# EAGLE board SniperBoard (EAGLE 6.4)
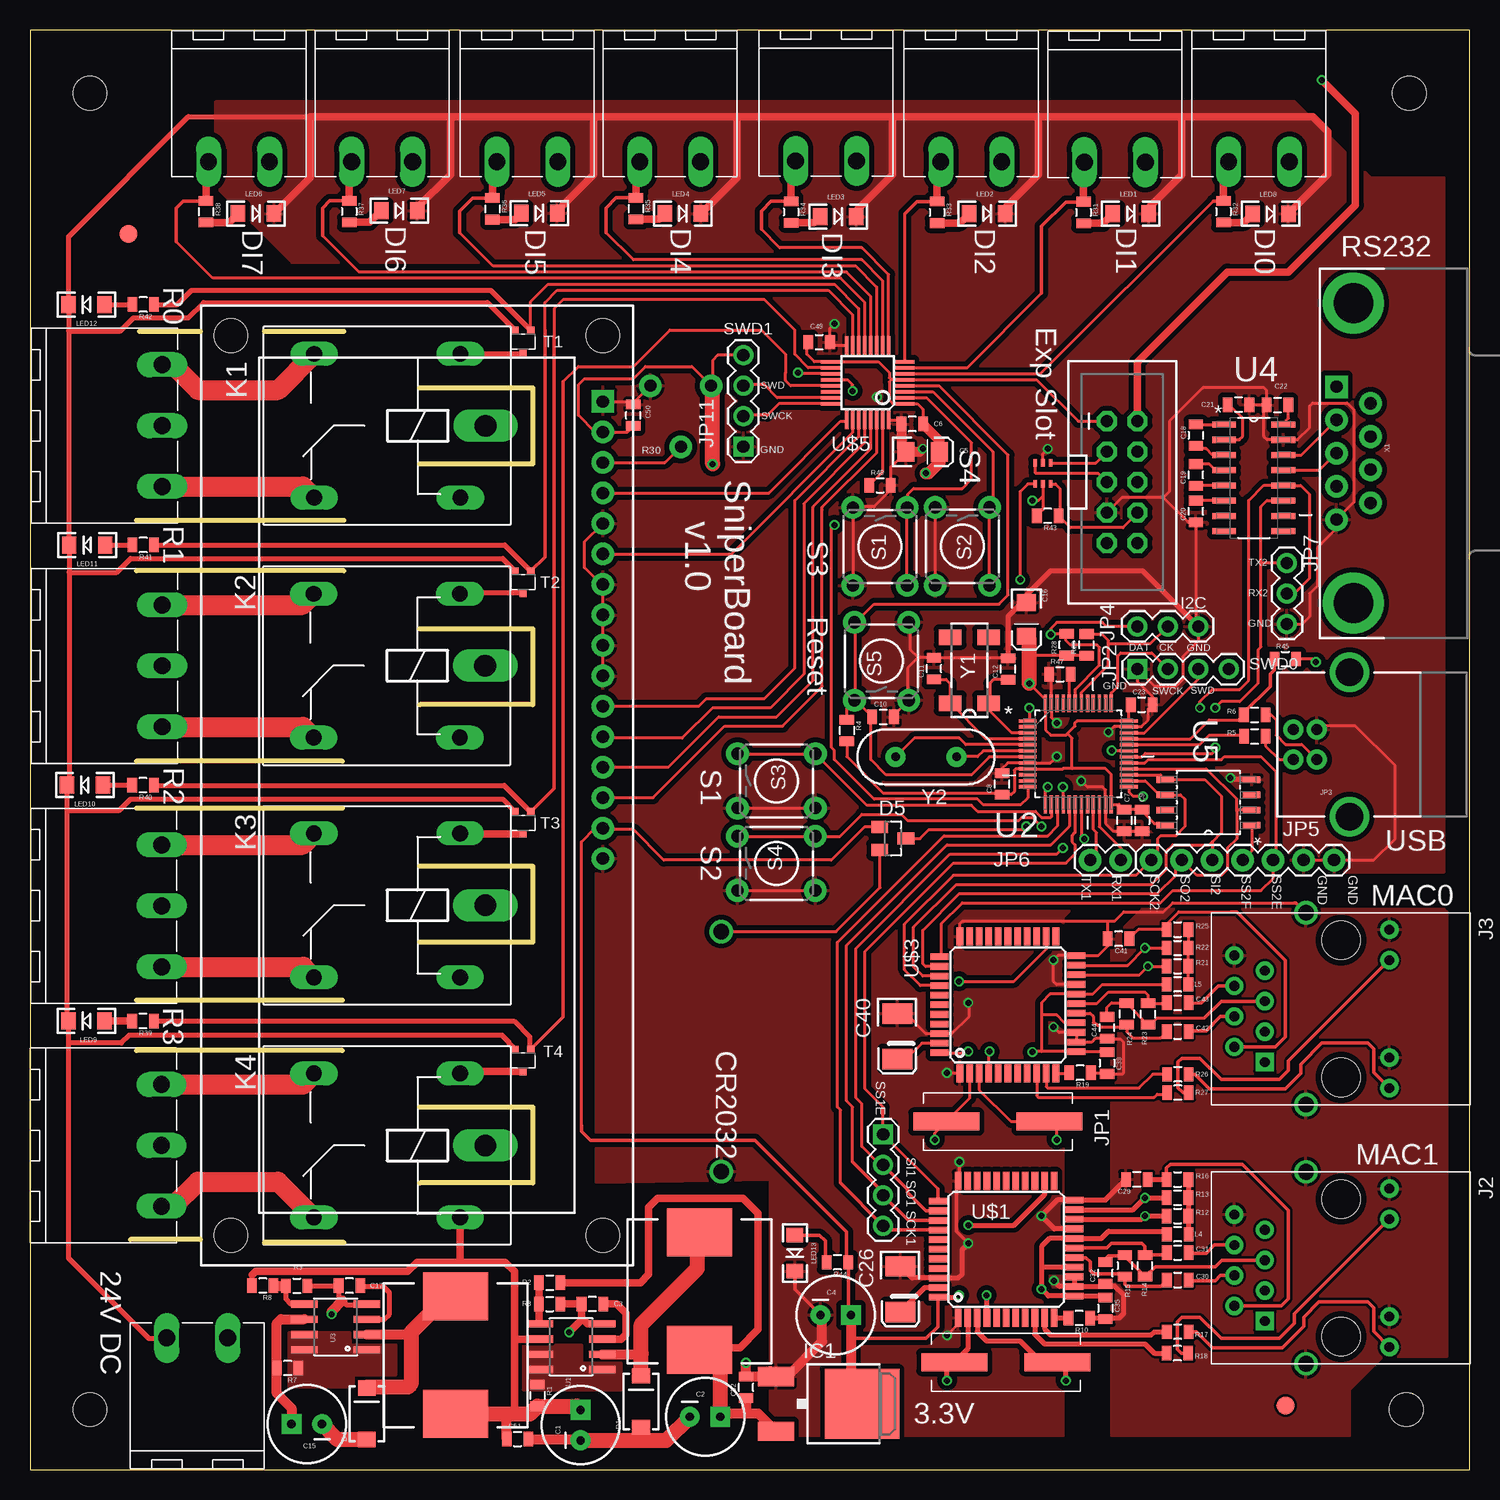
[diagram p5: board, top side]
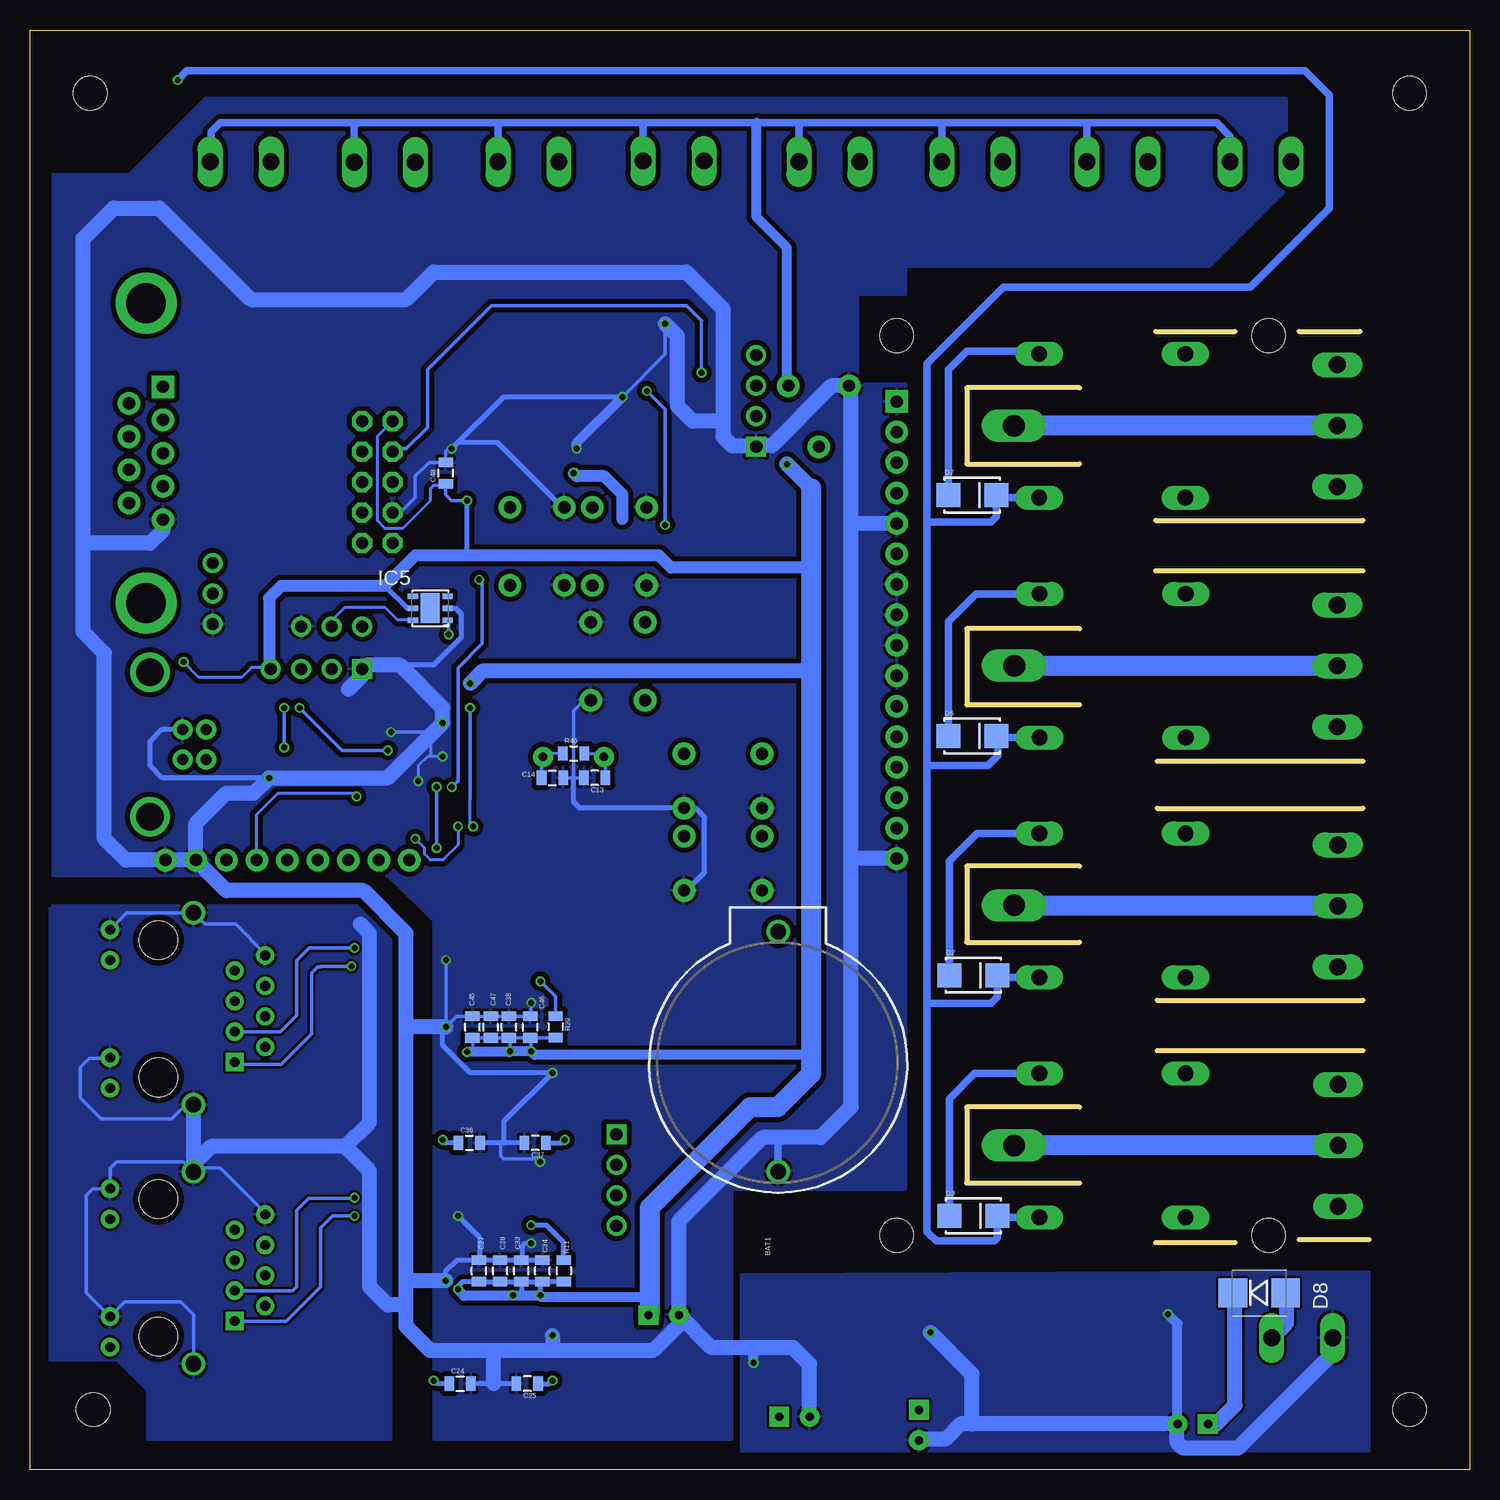
[diagram p6: board, bottom side, seen from below]

Size 120 x 120 mm. Coordinates in mm from the lower left corner, seen from the top.
Outline: 0,0 120,0 120,120 0,120 0,0
Copper layers (1*16): Top 0.035mm / dielectric 1.6mm / Bottom 0.035mm
Design rules "Elecrow_2-layer_PCB_eagle_rule *": minimum track width 8mil, minimum drill 12mil, track to track 8mil, track to pad 8mil, pad to pad 8mil, via to via 8mil, smd to smd 8mil, copper to edge 20mil, drill to drill 10mil, minimum pad ring 6mil, minimum via ring 6mil, stop-mask expansion 0mil, vias tented up to drill 100mil, thermal gap 10mil
Holes 2.8 mm at 5,114.73 114.99,114.73 114.73,5 5,5
Milling: 22 lines

## Footprints (pad centres in the part's own frame; a part is rotated, then mirrored left to right if it is on the bottom)
BATTCOM_20MM_PTH = drill 1.3: 1 20,0; 2 0,0
CPOL-RADIAL-100UF-25V = drill 0.7 pad 1.651 square: 1 1.27,0 | drill 0.7 pad 1.651: 2 -1.27,0
0805 = smd 0.8 x 1.2: 1 -0.9,0; 2 0.9,0
EIA3216 = smd 1.4 x 1.6: A 1.4,0; C -1.4,0
EIA3528-KIT = smd 1.7 x 2.5: A 1.9,0; C -1.9,0
SMA-DIODE = smd 1.27 x 1.47: A -2.15,0; C 2.15,0
SMA-DIODE_ALT = smd 2 x 2: A -2,0; C 2,0
SOT23 = smd 1 x 1.4: 1 -0.95,-1.1; 2 0.95,-1.1; 3 0,1.1
SMB-DIODE = smd 2.4 x 2.4: A 2.2,0; C -2.2,0
FIDUCIAL-1.5X3 = smd 1.5 x 1.5: 1 0,0
DPACK = smd 1.6 x 3: 1 -2.28,-4.8; 3 2.28,-4.8 | smd 5.8 x 6.2: 4 0,2.38
DFN6-3X3 = smd 0.85 x 0.45: 1 -1.45,1; 2 -1.45,0; 3 -1.45,-1; 4 1.45,-1; 5 1.45,0; 6 1.45,1 | smd 1.6 x 2.5: EXP 0,0
RJ45-ABRACON-111008B = drill 0.813 pad 1.524 square: 1 -6.35,-4.445 | drill 0.813 pad 1.524: 2 -8.89,-3.175; 3 -6.35,-1.905; 4 -8.89,-0.635; 5 -6.35,0.635; 6 -8.89,1.905; 7 -6.35,3.175; 8 -8.89,4.445; 9 4.039,-6.604; 10 4.039,-4.064; 11 4.039,4.064; 12 4.039,6.604 | drill 1.3 pad 1.778: SHIELD0 -2.921,8.001; SHIELD1 -2.921,-8.001 | hole 3.2: 0,-5.715; 0,5.715
1X04 = drill 1.016 pad 1.676 square: 1 0,0 | drill 1.016 pad 1.676: 2 2.54,0; 3 5.08,0; 4 7.62,0
USB-B-PTH = drill 0.914 pad 1.676: D+ 0,1.25; D- 1.981,1.25; GND 0,-1.25; VBUS 1.981,-1.25 | drill 2.286: S1 -2.718,-6.02; S2 -2.718,6.02
1X03 = drill 1.016 pad 1.676: 1 0,0; 2 2.54,0; 3 5.08,0
1X07 = drill 1.016 pad 1.88: 1 0,0; 2 2.54,0; 3 5.08,0; 4 7.62,0; 5 10.16,0; 6 12.7,0; 7 15.24,0
1X02 = drill 1.016 pad 1.88: 1 0,0; 2 2.54,0
2X5-SHROUDED = drill 1.016 pad 1.676 octagon: 1 -1.27,5.08; 2 1.27,5.08; 3 -1.27,2.54; 4 1.27,2.54; 5 -1.27,0; 6 1.27,0; 7 -1.27,-2.54; 8 1.27,-2.54; 9 -1.27,-5.08; 10 1.27,-5.08
ZF112 = drill 1.321 long: 1 -6.096,5.994; 2 -6.096,-5.994; O 6.096,5.994; S 6.096,-5.994 | drill 1.803 long: P -8.204,0
CDRH125 = smd 5.4 x 4: 1 0,4.9; 2 0,-4.9
LED-1206 = smd 1.2 x 1.4: A -1.5,0; C 1.5,0
TRIM_POT_PTH = drill 1 pad 1.88: 1 -2.54,-2.54; 2 0,2.54; 3 2.54,-2.54
TACTILE-PTH = drill 1.016 pad 1.88: 1 -3.251,2.261; 2 3.251,2.261; 3 -3.251,-2.261; 4 3.251,-2.261
SOT323 = smd 0.6 x 0.6: 1 -0.65,-0.925; 2 0.65,-0.925; 3 0,0.925
SO08 = smd 0.61 x 2.21: 1 -1.905,-2.616; 2 -0.635,-2.616; 3 0.635,-2.616; 4 1.905,-2.616; 5 1.905,2.616; 6 0.635,2.616; 7 -0.635,2.616; 8 -1.905,2.616
QFP50P900X900X160-48N = smd 1.473 x 0.279: 1 -4.216,2.743; 2 -4.216,2.261; 3 -4.216,1.753; 4 -4.216,1.245; 5 -4.216,0.762; 6 -4.216,0.254; 7 -4.216,-0.254; 8 -4.216,-0.762; 9 -4.216,-1.245; 10 -4.216,-1.753; 11 -4.216,-2.261; 12 -4.216,-2.743; 25 4.216,-2.743; 26 4.216,-2.261; 27 4.216,-1.753; 28 4.216,-1.245; 29 4.216,-0.762; 30 4.216,-0.254; 31 4.216,0.254; 32 4.216,0.762; 33 4.216,1.245; 34 4.216,1.753; 35 4.216,2.261; 36 4.216,2.743 | smd 0.279 x 1.473: 13 -2.743,-4.216; 14 -2.261,-4.216; 15 -1.753,-4.216; 16 -1.245,-4.216; 17 -0.762,-4.216; 18 -0.254,-4.216; 19 0.254,-4.216; 20 0.762,-4.216; 21 1.245,-4.216; 22 1.753,-4.216; 23 2.261,-4.216; 24 2.743,-4.216; 37 2.743,4.216; 38 2.261,4.216; 39 1.753,4.216; 40 1.245,4.216; 41 0.762,4.216; 42 0.254,4.216; 43 -0.254,4.216; 44 -0.762,4.216; 45 -1.245,4.216; 46 -1.753,4.216; 47 -2.261,4.216; 48 -2.743,4.216
SOIC127P600X175-16N = smd 1.981 x 0.508: 1 -2.464,4.445; 2 -2.464,3.175; 3 -2.464,1.905; 4 -2.464,0.635; 5 -2.464,-0.635; 6 -2.464,-1.905; 7 -2.464,-3.175; 8 -2.464,-4.445; 9 2.464,-4.445; 10 2.464,-3.175; 11 2.464,-1.905; 12 2.464,-0.635; 13 2.464,0.635; 14 2.464,1.905; 15 2.464,3.175; 16 2.464,4.445
SOIC127P800X215-8N = smd 1.473 x 0.533: 1 -3.607,1.905; 2 -3.607,0.635; 3 -3.607,-0.635; 4 -3.607,-1.905; 5 3.607,-1.905; 6 3.607,-0.635; 7 3.607,0.635; 8 3.607,1.905
LCD-16X2 = drill 1.016 pad 1.88 square: 1 -32,15.5 | drill 1.016 pad 1.88: 2 -29.46,15.5; 3 -26.92,15.5; 4 -24.38,15.5; 5 -21.84,15.5; 6 -19.3,15.5; 7 -16.76,15.5; 8 -14.22,15.5; 9 -11.68,15.5; 10 -9.14,15.5; 11 -6.6,15.5; 12 -4.06,15.5; 13 -1.52,15.5; 14 1.02,15.5; 15 3.56,15.5; 16 6.1,15.5 | hole 2.8: -37.5,15.5; -37.5,-15.5; 37.5,15.5; 37.5,-15.5
TQFP-44 = smd 1.5 x 0.55: 1 -5.7,4; 2 -5.7,3.2; 3 -5.7,2.4; 4 -5.7,1.6; 5 -5.7,0.8; 6 -5.7,0; 7 -5.7,-0.8; 8 -5.7,-1.6; 9 -5.7,-2.4; 10 -5.7,-3.2; 11 -5.7,-4; 23 5.7,-4; 24 5.7,-3.2; 25 5.7,-2.4; 26 5.7,-1.6; 27 5.7,-0.8; 28 5.7,0; 29 5.7,0.8; 30 5.7,1.6; 31 5.7,2.4; 32 5.7,3.2; 33 5.7,4 | smd 0.55 x 1.5: 12 -3.9,-5.7; 13 -3.1,-5.7; 14 -2.3,-5.7; 15 -1.5,-5.7; 16 -0.7,-5.7; 17 0.1,-5.7; 18 0.9,-5.7; 19 1.7,-5.7; 20 2.5,-5.7; 21 3.3,-5.7; 22 4.1,-5.7; 34 4,5.7; 35 3.2,5.7; 36 2.4,5.7; 37 1.6,5.7; 38 0.8,5.7; 39 0,5.7; 40 -0.8,5.7; 41 -1.6,5.7; 42 -2.4,5.7; 43 -3.2,5.7; 44 -4,5.7
1X02_TERMB_RA = drill 1.4 long: P$1 0,2.54; P$2 0,-2.54
SC70-6 = smd 0.61 x 0.305: P$1 -0.85,0; P$2 0.9,0; P$3 0.9,-0.65; P$4 -0.85,-0.65; P$5 -0.85,-1.3; P$6 0.9,-1.3
LQFP-32 = smd 0.279 x 1.575: 1 -1.75,-3.1; 2 -1.25,-3.1; 3 -0.75,-3.1; 4 -0.25,-3.1; 5 0.25,-3.1; 6 0.75,-3.1; 7 1.25,-3.1; 8 1.75,-3.1; 17 1.75,3.1; 18 1.25,3.1; 19 0.75,3.1; 20 0.25,3.1; 21 -0.25,3.1; 22 -0.75,3.1; 23 -1.25,3.1; 24 -1.75,3.1 | smd 1.575 x 0.279: 9 3.1,-1.75; 10 3.1,-1.25; 11 3.1,-0.75; 12 3.1,-0.25; 13 3.1,0.25; 14 3.1,0.75; 15 3.1,1.25; 16 3.1,1.75; 25 -3.1,1.75; 26 -3.1,1.25; 27 -3.1,0.75; 28 -3.1,0.25; 29 -3.1,-0.25; 30 -3.1,-0.75; 31 -3.1,-1.25; 32 -3.1,-1.75
1X03_TERMB_RA = drill 1.4 long: P$1 0,5.08; P$2 0,0; P$3 0,-5.08
DB9 = drill 1.016 pad 1.88 square: 1 -5.54,-1.42 | drill 1.016 pad 1.88: 2 -2.77,-1.42; 3 0,-1.42; 4 2.77,-1.42; 5 5.54,-1.42; 6 -4.15,1.42; 7 -1.38,1.42; 8 1.38,1.42; 9 4.15,1.42 | drill 3.302 pad 5.08: G1 -12.5,0; G2 12.5,0
MC-306 = smd 1.3 x 1.9: 1 -2.75,-1.6; 2 2.75,-1.6; 3 2.75,1.6; 4 -2.75,1.6
HC49US = drill 0.7 pad 1.651: 1 -2.54,0; 2 2.54,0
CRYSTAL-SMD-10.5X4.8-2PIN = smd 5.5 x 1.5: P$1 -4.3,0; P$2 4.3,0

## Placement (x,y rotation side)
BAT1  3V  [BATTCOM_20MM_PTH]  57.63,24.84 90 bottom
C1  100uF  [CPOL-RADIAL-100UF-25V]  45.9,3.7 90 top
C2  470uF  [CPOL-RADIAL-100UF-25V]  56.28,4.39 0 top
C3  470pF  [0805]  46.88,13.79 180 top
C4  470uF  [CPOL-RADIAL-100UF-25V]  67.17,12.88 0 top
C5  10uF  [EIA3216]  74.42,84.84 0 top
C6  0.1uF  [0805]  73.55,87.16 180 top
C7  0.1uF  [0805]  91.21,54.1 270 top
C8  0.1uF  [0805]  81.03,57.15 90 top
C9  0.1uF  [0805]  92.71,54.1 270 top
C10  0.1uF  [0805]  71.12,62.74 0 top
C11  20pF  [0805]  75.36,66.77 90 top
C12  20pF  [0805]  81.53,66.74 90 top
C13  27pF  [0805]  72.93,57.65 180 bottom
C14  27pF  [0805]  76.45,57.66 0 bottom
C15  100uF  [CPOL-RADIAL-100UF-25V]  23.08,3.79 180 top
C16  10uF  [EIA3216]  83.06,70.87 270 top
C17  220pF  [0805]  26.63,15.32 180 top
C18  0.1uF  [0805]  97.19,86.22 270 top
C19  0.1uF  [0805]  97.19,82.92 90 top
C20  0.1uF  [0805]  97.19,79.87 90 top
C21  0.1uF  [0805]  100.74,88.76 180 top
C22  0.1uF  [0805]  104,88.74 0 top
C23  0.1uF  [0805]  92.67,63.77 0 top
C24  27pF  [0805]  84.14,7.16 0 bottom
C25  27pF  [0805]  78.55,7.16 180 bottom
C26  10uF  [EIA3528-KIT]  72.55,15.03 270 top
C27  0.1uF  [0805]  82.59,16.56 90 bottom
C28  0.1uF  [0805]  80.81,16.56 90 bottom
C29  0.01uF  [0805]  92.27,24.18 180 top
C30  0.01uF  [0805]  95.67,15.8 0 top
C31  0.01uF  [0805]  95.67,18.08 0 top
C32  0.01uF  [0805]  89.65,16.38 90 top
C33  0.1uF  [0805]  79.06,16.56 90 bottom
C34  0.1uF  [0805]  77.28,16.56 90 bottom
C35  0.1uF  [0805]  89.65,13.43 270 top
C36  27pF  [0805]  83.38,27.23 0 bottom
C37  27pF  [0805]  77.89,27.23 180 bottom
C38  0.1uF  [0805]  80.07,36.88 90 bottom
C39  0.1uF  [0805]  89.78,33.88 270 top
C40  10uF  [EIA3528-KIT]  72.3,36.12 270 top
C41  0.01uF  [0805]  90.74,44.24 180 top
C42  0.01uF  [0805]  95.67,36.5 0 top
C43  0.01uF  [0805]  95.67,38.91 0 top
C44  0.01uF  [0805]  89.78,36.83 90 top
C45  0.1uF  [0805]  83.12,36.88 90 bottom
C46  0.1uF  [0805]  78.3,36.88 90 bottom
C47  0.1uF  [0805]  81.6,36.88 90 bottom
C48  0.1uF  [0805]  85.34,83.06 90 bottom
C49  0.1uF  [0805]  65.79,93.98 0 top
C50  0.1uF  [0805]  50.29,87.88 90 top
C51  0.1uF  [0805]  40.64,2.54 0 top
C52  0.1uF  [0805]  59.69,6.86 90 top
D1  STPS2L40U  [SMA-DIODE]  50.94,5.66 90 top
D2  1N4148WS-V-GS18  [SMA-DIODE_ALT]  41.35,41.21 0 bottom
D3  1N4148WS-V-GS18  [SMA-DIODE_ALT]  41.35,21.14 0 bottom
D4  STPS2L40U  [SMA-DIODE]  28.08,4.65 90 top
D5  BAS40-05  [SOT23]  71.93,52.6 270 top
D6  1N4148WS-V-GS18  [SMA-DIODE_ALT]  41.45,61.16 0 bottom
D7  1N4148WS-V-GS18  [SMA-DIODE_ALT]  41.45,81.22 0 bottom
D8  [SMB-DIODE]  17.53,14.73 0 bottom
FID1  FIDUCIAL1.5X3  [FIDUCIAL-1.5X3]  104.65,5.33 0 top
FID2  FIDUCIAL1.5X3  [FIDUCIAL-1.5X3]  8.22,103 0 top
IC1  LD117ADT12TR  [DPACK]  66.98,5.48 270 top
IC5  SI7006-A10-IM  [DFN6-3X3]  86.64,71.8 180 bottom
J2  RJ45-ABRACON-11108B  [RJ45-ABRACON-111008B]  109.28,16.81 0 top
J3  RJ45-ABRACON-11108B  [RJ45-ABRACON-111008B]  109.28,38.4 0 top
JP1  [1X04]  71.12,27.94 270 top
JP2  SWD0  [1X04]  92.31,66.72 0 top
JP3  USB-B  [USB-B-PTH]  107.28,60.44 180 top
JP4  [1X03]  97.38,70.28 180 top
JP5  [1X07]  108.71,50.8 180 top
JP6  [1X02]  90.93,50.8 180 top
JP7  [1X03]  104.78,70.48 90 top
JP11  [1X04]  59.47,85.26 90 top
JP12  M05X2SHD  [2X5-SHROUDED]  91.05,82.31 0 top
K1  ZF112  [ZF112]  29.77,87.01 180 top
K2  ZF112  [ZF112]  29.74,67 180 top
K3  ZF112  [ZF112]  29.76,47.03 180 top
K4  ZF112  [ZF112]  29.76,27.01 180 top
L1  68uH  [CDRH125]  55.8,14.87 0 top
L3  68uH  [CDRH125]  35.48,9.54 0 top
L4  10uH  [0805]  95.67,19.61 180 top
L5  10uH  [0805]  95.67,40.43 180 top
LED1  Green  [LED-1206]  91.76,104.69 0 top
LED2  Green  [LED-1206]  79.8,104.69 0 top
LED3  Green  [LED-1206]  67.38,104.45 0 top
LED4  Green  [LED-1206]  54.42,104.7 0 top
LED5  Green  [LED-1206]  42.45,104.72 0 top
LED6  Green  [LED-1206]  18.85,104.7 0 top
LED7  Green  [LED-1206]  30.78,104.94 0 top
LED8  Green  [LED-1206]  103.41,104.67 0 top
LED9  Green  [LED-1206]  4.7,37.4 180 top
LED10  Green  [LED-1206]  4.57,57.05 180 top
LED11  Green  [LED-1206]  4.77,77.07 180 top
LED12  Green  [LED-1206]  4.71,97.11 180 top
LED13  Green  [LED-1206]  63.75,18.03 270 top
R1  0.68R  [0805]  42.31,6.17 270 top
R2  3.6K  [0805]  43.32,15.57 0 top
R3  1.2K  [0805]  43.32,13.79 0 top
R4  10K  [0805]  68.09,61.61 270 top
R5  22R  [0805]  102.09,61.12 0 top
R6  22R  [0805]  102.08,62.9 0 top
R7  0.68R  [0805]  21.48,8.46 180 top
R8  13K  [0805]  19.41,15.33 180 top
R9  1.5K  [0805]  22.24,15.32 0 top
R10  12.4K  [0805]  87.47,12.63 180 top
R11  100K  [0805]  75.5,16.56 270 bottom
R12  49.9R  [0805]  95.67,21.13 0 top
R13  49.9R  [0805]  95.67,22.65 0 top
R14  49.9R  [0805]  92.95,16.99 90 top
R15  49.9R  [0805]  91.27,16.99 270 top
R16  10R  [0805]  95.67,24.18 0 top
R17  470R  [0805]  95.67,11.48 180 top
R18  470R  [0805]  95.64,9.7 180 top
R19  12.4K  [0805]  87.54,33.07 180 top
R20  100K  [0805]  76.19,36.91 270 bottom
R21  49.9R  [0805]  95.67,41.96 0 top
R22  49.9R  [0805]  95.67,43.48 0 top
R23  49.9R  [0805]  93.2,37.97 90 top
R24  49.9R  [0805]  91.43,37.97 270 top
R25  10R  [0805]  95.67,45.01 0 top
R26  470R  [0805]  95.69,32.94 180 top
R27  470R  [0805]  95.69,31.42 180 top
R28  10K  [0805]  86.42,68.76 90 top
R29  10K  [0805]  88.08,68.75 90 top
R30  TRIMPOT 10K  [TRIM_POT_PTH]  54.25,87.8 180 top
R31  470R  [0805]  87.83,104.79 270 top
R32  470R  [0805]  99.49,104.85 270 top
R33  470R  [0805]  75.61,104.8 270 top
R34  470R  [0805]  63.44,104.82 270 top
R35  470R  [0805]  50.51,105.11 270 top
R36  470R  [0805]  38.56,105.09 270 top
R37  470R  [0805]  26.62,104.86 270 top
R38  470R  [0805]  14.68,104.85 270 top
R39  470R  [0805]  9.42,37.39 180 top
R40  470R  [0805]  9.42,57.04 180 top
R41  470R  [0805]  9.43,77.07 180 top
R42  470R  [0805]  9.43,97.12 180 top
R43  10K  [0805]  84.84,79.5 180 top
R44  470R  [0805]  67.31,17.27 180 top
R45  1.5K  [0805]  104.65,67.56 0 top
R46  1M  [0805]  74.68,59.69 0 bottom
R47  100K  [0805]  85.85,66.29 0 top
R48  100K  [0805]  70.87,82.04 0 top
S1  [TACTILE-PTH]  70.86,76.95 270 top
S2  [TACTILE-PTH]  77.72,76.96 270 top
S3  [TACTILE-PTH]  62.23,57.4 0 top
S4  [TACTILE-PTH]  62.22,50.53 0 top
S5  [TACTILE-PTH]  70.99,67.38 90 top
T1  2N7002PW  [SOT323]  41.1,94.04 180 top
T2  2N7002PW  [SOT323]  41.1,73.97 180 top
T3  2N7002PW  [SOT323]  41.1,53.91 180 top
T4  2N7002PW  [SOT323]  41.1,34.09 180 top
U1  MC34063SMD  [SO08]  45.1,10.24 90 top
U2  STM32F103CBT6  [QFP50P900X900X160-48N]  87.39,59.66 0 top
U3  MC34063SMD  [SO08]  25.48,11.89 90 top
U4  ST232CDR  [SOIC127P600X175-16N]  102.01,82.66 0 top
U5  S25FL016K0XMFI011  [SOIC127P800X215-8N]  98.23,55.61 180 top
U6  LCD-16X2SILK  [LCD-16X2]  32.25,57.03 270 top
U$1  ENC424J600  [TQFP-44]  81.37,18.36 90 top
U$2  1X02_TERMB_RA  [1X02_TERMB_RA]  13.95,10.97 270 top
U$3  ENC424J600  [TQFP-44]  81.52,38.73 90 top
U$4  NC7SP157  [SC70-6]  85.09,83.06 270 top
U$5  STM32F030K6T6-LQFP-32  [LQFP-32]  69.83,90.6 90 top
U$6  1X02_TERMB_RA  [1X02_TERMB_RA]  102.45,109.03 90 top
U$7  1X02_TERMB_RA  [1X02_TERMB_RA]  90.43,108.98 90 top
U$8  1X02_TERMB_RA  [1X02_TERMB_RA]  66.36,109.08 90 top
U$9  1X02_TERMB_RA  [1X02_TERMB_RA]  41.45,109.03 90 top
U$10  1X02_TERMB_RA  [1X02_TERMB_RA]  17.42,109.03 90 top
U$11  1X02_TERMB_RA  [1X02_TERMB_RA]  29.35,109.03 90 top
U$12  1X02_TERMB_RA  [1X02_TERMB_RA]  53.37,109.03 90 top
U$13  1X02_TERMB_RA  [1X02_TERMB_RA]  78.46,109.03 90 top
U$14  1X03_TERMB_RA  [1X03_TERMB_RA]  11.02,87.02 180 top
U$15  1X03_TERMB_RA  [1X03_TERMB_RA]  11.02,66.99 180 top
U$16  1X03_TERMB_RA  [1X03_TERMB_RA]  10.98,46.99 180 top
U$17  1X03_TERMB_RA  [1X03_TERMB_RA]  10.96,27.02 180 top
X1  [DB9]  110.33,84.72 270 top
Y1  32.768Khz  [MC-306]  78.31,66.63 90 top
Y2  8Mhz  [HC49US]  74.69,59.4 180 top
Y3  25Mhz  [CRYSTAL-SMD-10.5X4.8-2PIN]  81.34,8.94 180 top
Y4  25Mhz  [CRYSTAL-SMD-10.5X4.8-2PIN]  80.68,29 180 top

## Tracks (layer width: path | path; a pad name or v marks a point on that pad's centre or on a via)
3.3V  (via drill 0.5 pad 0.81)
  Top 0.254: L5.2 89.39,40.43 88.59,39.63 U$3.18 85.04,39.63 84.31,38.91 84.31,37.89 | C39.1 89.72,34.83 U$3.12 84.33,34.83 | 84.33,34.83 83.6,34.83 v83.57,34.8 | U$3.4 79.92,34.77 v80,34.85 | U$3.44 78.11,34.73 v78.22,34.85 | U$3.15 86.24,37.23 85.58,37.89 84.31,37.89 | U5.8 94.48,53.85 93.73,53.85 92.71,54.86 C9.1 C7.1 90.78,55.44 U2.24 90.14,57.95 89.66,58.42 86.87,58.42 | C23.1 91.61,63.61 U2.36 87.29,62.4 87.12,62.23 87.12,61.98 86.49,61.34 | 86.87,58.42 86.11,58.42 86.1,58.41 U2.9 82.16,58.41 82.04,58.29 82.04,56.52 81.79,56.26 81.04,56.26 C8.1 80.89,56.39 71.12,56.39 68.09,59.42 R4.2 | C50.1 49.79,86.49 U6.2 47.12,86.49 45.72,87.88 45.72,90.42 46.23,90.93 50.29,90.93 51.31,91.95 55.18,91.95 R30.1 56.9,90.45 56.9,92.46 57.32,92.88 JP11.4 | C49.1 64.77,93.86 64.77,92.96 65.39,92.35 U$5.17 70.72,92.35 71.63,91.44 71.63,91.02 71.8,90.85 | C6.1 74.42,87.19 74.42,88.39 73.97,88.85 U$5.1 71.93,88.85 71.63,89.15 71.63,90.68 71.8,90.85 | D5.1 69.55,53.55 66.8,50.8 52.83,50.8 50.29,53.34 47.88,53.34 U6.15 47.12,53.47 45.97,52.32 45.97,28.7 | R43.2 84.44,80.01 U$4.P$3 84.44,81.14 84.07,80.77 v83.57,80.77 | 84.31,37.89 84.31,34.85 84.33,34.83 | 86.87,58.42 86.87,60.96 86.49,61.34 | 86.49,61.34 86.36,61.21 85.09,61.21 84.65,61.66 U2.48 84.65,64.19 v83.31,65.53 | JP12.1 89.77,87.38 87.38,87.38 83.9,90.85 U$5.5 71.8,90.85 | v107.19,67.31 106.93,67.56 R45.2 | R29.1 86.43,67.85 R28.1 83.35,67.86 83.31,67.82
  Top 0.305: U$1.44 75.67,11.91 74.68,10.92 68.69,10.92 68.44,10.67 | 45.97,28.7 45.97,28.19 46.74,27.43 60.45,27.43 68.07,19.81 68.07,17.41 R44.1 68.21,13.11 C4.1
  Top 0.406: L4.2 94.52,19.86 89.9,19.86 89.3,19.26 U$1.18 84.98,19.26 84.31,18.59 84.31,16.81 | C35.1 89.52,14.46 U$1.12 84.89,14.46 v84.31,15.03 84.31,16.81 | U$1.4 79.77,14.5 v79.74,14.53 | U$1.44 77.29,14.36 v77.46,14.53 | U$1.15 84.36,16.86 84.31,16.81
  Top 0.813: C4.1 68.44,10.67 68.44,6.4 IC1.4 | C5.A 75.82,85.79 C6.1
  Top 1.016: v74.68,83.06 74.93,83.06 75.82,83.95 C5.A
  Top 1.27: v83.31,65.53 83.31,67.82 83.31,69.21 C16.A | v56.9,83.82 56.9,90.24 R30.1
  Bottom 0.254: v83.57,34.8 83.31,34.8 83.06,35.05 83.06,35.92 C45.1 | C48.1 85.46,82.04 86.36,82.04 86.61,81.79 86.61,80.77 88.9,78.49 90.42,78.49 91.03,79.1 91.03,86.13 JP12.1 | 100.08,66.86 101.54,66.86 102.36,66.04 105.92,66.04 v107.19,67.31
  Bottom 0.305: C46.1 C38.1 | C38.1 C47.1 C45.1 83.24,35.86 | v80,34.85 80,35.9 C38.1 | C46.1 76.21,35.98 R20.2 | v78.22,34.85 78.22,35.9 C46.1 | v83.57,80.77 84.84,80.77 85.34,81.28 C48.1 | 68.33,12.99 C4.1 | 68.33,13.72 68.33,14.25 | 68.33,14.25 68.44,14.37 | 68.33,14.25 68.33,16.26 68.07,16.51
  Bottom 0.406: v84.31,15.03 84.31,15.29 83.95,15.66 C27.1 C28.1 C33.1 | C33.1 C34.1 | v79.74,14.53 79.23,14.53 78.98,14.78 78.98,15.58 C33.1 | v77.46,14.53 77.46,15.48 C34.1 | R11.2 C34.1 | v83.57,80.77 83.57,76.45 83.82,76.2 | IC5.5 88.57,71.8 90.42,73.66
  Bottom 0.61: U$10.P$2 19.96,111.15 21.08,112.27 31.75,112.27 | 31.75,112.27 44.2,112.27 | 44.2,112.27 55.63,112.27 | 55.63,112.27 59.44,112.27 69.09,112.27 | 69.09,112.27 81.03,112.27 | 81.03,112.27 92.71,112.27 | 92.71,112.27 104.14,112.27 104.9,111.51 104.9,109.11 U$6.P$2 | U$7.P$2 92.97,112.01 92.71,112.27 | U$13.P$2 81,112.24 81.03,112.27 | U$12.P$2 55.91,111.99 55.63,112.27 | U$9.P$2 43.99,112.06 44.2,112.27 | U$11.P$2 31.89,112.13 31.75,112.27 | U$8.P$2 68.9,112.08 69.09,112.27
  Bottom 0.813: 54.86,34.54 77.92,34.54 v78.22,34.85 79.96,34.85 80.01,34.8 v83.57,34.8 | 68.44,14.37 77.36,14.37 77.47,14.48 83.82,14.48 84.33,14.99 | 56.9,90.24 56.9,101.85 59.44,104.39 59.44,112.27
  Bottom 1.016: 54.86,75.18 66.55,75.18 67.56,76.2 83.82,76.2 87.88,76.2 90.42,73.66 99.06,73.66 100.08,72.64 100.08,66.86 JP2.4 | 70.61,79.25 70.61,81.28 72.14,82.8 74.42,82.8 v74.68,83.06
  Bottom 1.27: 54.86,66.55 82.3,66.55 v83.31,65.53 | 54.86,81.79 v56.9,83.82
  Bottom 1.676: 68.33,12.99 68.33,13.72 68.33,21.84 59.94,30.23 57.66,30.23 54.86,33.02 54.86,34.54 54.86,66.55 54.86,75.18 54.86,81.79 | 56.9,90.24 R30.1
232_RX
  Top 0.254: U4.13 107.48,83.3 X1.3
232_TX
  Top 0.254: U4.14 105.98,84.57 X1.2
+5V
  Top 0.61: R2.2 50.88,15.57 51.56,16.26 51.56,21.84 52.32,22.61 59.44,22.61 60.71,21.34 60.71,11.68 59.18,10.16 55.99,10.16 L1.2
  Top 0.813: IC1.3 60.73,4.65 59.69,4.65 | 59.69,4.65 57.8,4.65 C2.1 | C52.1 59.69,4.65
  Top 1.27: C2.1 57.55,8.23 L1.2
+12V  (via drill 0.5 pad 0.81)
  Top 0.406: 35.92,21.08 K4.1 | R8.2 18.51,16.22
  Top 0.61: JP12.2 92.32,92.32 99.82,99.82 104.9,99.82 110.49,105.41 110.49,113.03 v107.7,115.82 | 18.51,16.22 18.8,16.51 31.5,16.51 32.26,17.27 35.81,17.27 | 35.81,17.27 39.62,17.27 40.39,16.51 40.39,10.92 | 40.39,10.92 40.39,4.57 41.61,4.57 R1.2 | U1.6 40.44,10.87 40.39,10.92 | K4.1 35.86,17.32 35.81,17.27
  Top 0.813: C51.1 39.74,4.5 39.88,4.64
  Top 1.27: L3.2 39.88,4.64 41.67,4.64 R1.2 45.59,5.27 C1.1
  Bottom 0.61: K4.1 39.23,21.02 D3.C 39.35,19.32 39.62,19.05 44.45,19.05 45.21,19.81 45.21,39.12 | K1.1 39.24,81.01 D7.C 39.45,79.42 39.88,78.99 45.21,78.99 | K2.1 39.3,61.01 | 39.3,61.01 D6.C | K3.1 39.18,41.03 D2.C 39.35,39.39 39.88,38.86 44.96,38.86 45.21,39.12 | 45.21,78.99 45.21,92.2 38.86,98.55 18.29,98.55 11.68,105.16 11.68,114.55 13.72,116.59 106.93,116.59 v107.7,115.82 | 45.21,78.99 45.21,58.67 | 45.21,58.67 45.21,39.12 | 39.3,61.01 39.3,59.5 40.13,58.67 45.21,58.67
BOOT0
  Top 0.254: U2.44 86.63,66.17 R47.2
DAISY_MUX
  Top 0.254: U$4.P$5 83.79,83.09 83.82,83.06 89.03,83.06 JP12.5
DAISY_RX0  (via drill 0.5 pad 0.81)
  Top 0.254: 84.82,56.91 v84.84,56.9 84.65,56.71 U2.13 | v82.55,74.17 82.55,81.53 83.17,82.16 U$4.P$6
  Bottom 0.305: v84.84,56.9 84.33,57.4 84.33,66.8 82.3,68.83 82.3,73.91 v82.55,74.17
DAISY_RX1  (via drill 0.5 pad 0.81)
  Top 0.254: v67.06,78.74 66.8,78.49 66.8,60.2 67.06,59.94 67.06,59.18 70.36,55.88 78.99,55.88 79.43,55.44 82.62,55.44 83.18,56 U2.12 | v68.58,89.92 68.58,90.42 68.16,90.85 U$5.20
  Bottom 0.305: v67.06,78.74 67.06,88.39 v68.58,89.92
DAISY_RX2  (via drill 0.5 pad 0.81)
  Top 0.254: U$4.P$1 88.84,83.91 JP12.3 | U$5.19 64.1,91.35 v64.01,91.44
  Bottom 0.254: v64.01,91.44 64.01,95.75 64.01,95.76
  Bottom 0.305: 64.01,95.76 65.28,97.03 81.53,97.03 86.87,91.69 86.87,86.87 88.65,85.09 89.54,85.09 JP12.3
DI_0
  Top 0.254: 98.64,105.75 84.24,91.35 U$5.6
  Top 0.305: R32.1 98.64,105.75
  Top 0.61: R32.1 99.49,108.6 U$6.P$1
DI_1
  Top 0.254: 84.33,98.04 78.13,91.85 U$5.7
  Top 0.305: 84.33,98.04 84.33,103.63 86.36,105.66 87.8,105.66 R31.1
  Top 0.61: R31.1 87.83,108.91 U$7.P$1
DI_2
  Top 0.254: U$5.8 72.93,104.68
  Top 0.305: 72.93,104.68 73.95,105.7 R33.1
  Top 0.61: R33.1 75.61,108.72 U$13.P$1
DI_3
  Top 0.254: U$5.9 71.58,99.61 69.34,101.85 62.48,101.85 60.96,103.38
  Top 0.305: 60.96,103.38 60.96,104.9 61.78,105.72 R34.1
  Top 0.61: R34.1 63.44,108.7 U$8.P$1
DI_4
  Top 0.254: U$5.10 71.08,99.1 69.34,100.84 50.29,100.84 48.01,103.12
  Top 0.305: 48.01,103.12 48.01,105.16 48.86,106.01 R35.1
  Top 0.61: R35.1 50.51,108.7 U$12.P$1
DI_5
  Top 0.254: U$5.11 70.58,98.58 68.83,100.33 38.61,100.33 35.81,103.12
  Top 0.305: 35.81,103.12 35.81,104.9 36.9,105.99 R36.1
  Top 0.61: R36.1 38.56,108.67 U$9.P$1
DI_6
  Top 0.254: U$5.12 70.08,97.81 68.07,99.82 27.43,99.82 24.38,102.87
  Top 0.305: 24.38,102.87 24.38,105.16 24.99,105.76 R37.1
  Top 0.61: R37.1 26.62,108.84 U$11.P$1
DI_7
  Top 0.254: U$5.13 69.58,97.3 67.56,99.31 15.24,99.31 12.19,102.36
  Top 0.305: 12.19,102.36 12.19,105.16 12.78,105.75 R38.1
  Top 0.61: R38.1 14.68,108.83 U$10.P$1
DO_0
  Top 0.254: U$5.14 69.08,96.78 67.06,98.81 43.18,98.81 41.75,97.37 T1.1
  Top 0.406: T1.1 38.41,98.3 13.46,98.3 12.28,97.12 R42.1
DO_1
  Top 0.254: U$5.15 68.58,96.26 66.55,98.3 43.94,98.3 42.93,97.28 42.93,95
  Top 0.305: 42.93,95 42.93,76.08 T2.1
  Top 0.406: R41.1 39.58,77.07 T2.1
DO_2
  Top 0.254: U$5.18 64.87,91.85 63.75,92.96 63.75,95 61.21,97.54 44.45,97.54 43.69,96.77 43.69,94.49
  Top 0.305: 43.69,94.49 43.69,56.77 T3.1
  Top 0.406: R40.1 39.54,57.04 T3.1
DO_3
  Top 0.254: U$5.21 63.41,90.35 62.99,90.78 62.99,91.44 62.99,92.96 60.96,95 53.34,95 50.29,91.95 45.72,91.95 44.45,90.68
  Top 0.305: 44.45,90.68 44.45,37.72 T4.1
  Top 0.406: T4.1 41.66,35.11 41.66,36.07 40.34,37.39 R39.1
G_RESET
  Top 0.254: U2.7 79.98,59.4 78.49,57.91 71.37,57.91 70.1,59.18 70.1,62.62 C10.1 68.83,64.13 | 68.83,64.13 S5.1 68.09,63.48 R4.1 | 68.83,64.13 68.83,70.53 S5.2 68.85,70.63 70.36,72.14 80.77,72.14 81.53,72.9 81.53,84.58 75.77,90.35 U$5.4
GND  (via drill 0.5 pad 0.81)
  Top 0.254: R19.1 89.69,33.07 C39.2 91.08,32.98 91.17,33.07 91.17,35.61 90.92,35.86 89.84,35.86 C44.1 88.83,35.93 88.5,35.61 87.25,35.61 U$3.13 U$3.14 85.77,36.43 v85.33,36.88 | U$3.19 85.58,40.43 85.33,40.69 v85.33,42.47 85.7,42.83 U$3.22 89.06,42.83 89.92,43.69 89.92,44.17 C41.2 89.84,45.65 89.92,45.72 | v78.22,38.91 78.3,38.83 C46.2 76.85,36.33 U$3.42 75.78,36.37 74.66,36.37 73.02,38.02 C40.C | U$3.1 76.47,33.03 v76.44,33.07 | C21.1 103.08,88.76 C22.1 | C22.1 102.87,88.51 102.87,86.11 103.14,85.84 U4.15 105.65,85.84 106.68,86.87 106.68,88.65 106.93,88.9 109.8,88.9 110.36,88.34 110.36,80.64 X1.5 108.91,78.43 107.31,76.83 107.31,73.66 106.68,73.03 106.68,71.12 106.05,70.48 JP7.1 | U$3.33 77.52,45.52 77.72,45.72 89.92,45.72 | 89.92,45.72 90.42,45.72 91.19,46.48 94.49,46.48 95.25,47.24 105.41,47.24 | JP5.2 JP5.1 112.01,50.8 113.79,52.58 113.79,58.67 110.49,61.98 107.57,61.98 JP3.GND | C9.2 C7.2 90.31,53.2 89.65,53.86 U2.23 89.65,56.65 89.41,56.9 88.17,56.9 88.15,56.88 v87.63,57.4 | C11.2 81.5,67.67 C12.2 | C10.2 72.02,62.9 S5.3 73.15,64.23 73.15,66.8 74.02,67.67 C11.2 | S3.3 S3.4 | v89.92,61.47 90.37,61.92 U2.35 92.65,61.92 93.22,62.48 93.22,63.42 C23.2 93.57,64.42 92.31,65.67 JP2.1 93.76,65.28 95.5,65.28 96.09,65.86 96.09,67.77 97.38,69.06 JP4.1 97.19,70.48 C20.1 96.55,78.97 94.49,81.03 | U6.1 50.05,89.03 C50.2 50.29,88.92 R30.3 | U6.10 U6.9 U6.8 U6.7 47.63,73.79 46.23,75.18 46.23,77.34 U6.5 | C11.2 74.06,67.67 73.41,68.33 73.41,70.48 S5.4 | U$4.P$4 84.44,84.69 v84.84,85.09 | 94.49,81.03 91.04,81.03 JP12.7 | S1.4 S1.3 68.66,80.26 70.36,80.26 71.77,81.67 R48.2 71.77,83.58 C5.C
  Top 0.254: v67.06,95.5 66.69,95.13 C49.2 66.97,93.7 U$5.16 | C22.1 103.1,89.94 102.87,90.17 97.79,90.17 95,87.38 95,81.53 94.49,81.03 | 77.37,12.09 v76.45,11.18 | 85.34,62.48 v85.6,62.23 85.13,62.7 U2.47 85.13,66.11 R47.1 | v85.6,59.44 85.06,58.9 U2.8 81.5,58.9 81.03,58.42 C8.2 | S2.4 S2.3 | S4.3 S4.4 | U$5.32 72.31,87.5 C6.2
  Top 0.305: U$1.1 77.37,12.09 | v78.22,18.84 77.22,19.85 77.22,23.91 U$1.33 77.47,24.16 v77.47,25.65 | LED13.C 63.75,15.02 C4.2 | 105.41,47.24 105.52,47.24 J3.SHIELD0
  Top 0.406: C29.2 89.65,22.46 U$1.22 85.64,22.46 v84.31,21.13 85.38,20.06 U$1.19 | U$1.13 89.43,15.26 C32.1 89.84,15.29 90.41,15.29 91.17,14.53 91.17,13 90.8,12.63 89.55,12.63 | R10.1 89.55,12.63 | 89.55,12.63 C35.2 | U$1.14 U$1.13 | v78.22,18.84 77.71,18.34 77.71,16.3 77.37,15.96 U$1.42 73.53,15.96 C26.C | 3.21,94.92 LED12.C 3.21,102.78 13.21,112.78 23.37,112.78 | 3.21,94.92 3.21,77.13 LED11.C 3.27,74.78 | 3.27,74.78 3.27,57.25 LED10.C 3.07,54.95 | 3.07,54.95 3.07,36.89 LED9.C 3.2,35.56 | 3.2,35.56 3.2,17.63 9.91,10.92 11.36,10.92 U$2.P$2 | T4.2 39.91,35.56 39.91,35.66 39.37,36.2 8.26,36.2 7.62,35.56 3.2,35.56 | 3.07,54.95 7.45,54.95 8.38,55.88 39.4,55.88 T3.2 | 3.27,74.78 7.22,74.78 8.38,75.95 39.4,75.95 T2.2 | 3.21,94.92 7.54,94.92 8.64,96.01 13.21,96.01 14.48,97.28 38.13,97.28 T1.2 | LED8.C 104.91,104.66 | U5.4 100.22,57.51 v100.08,57.66 | C12.2 81.53,71.12 82.68,72.27 C16.C 83.06,72.9 85.09,74.93 92.73,74.93 JP4.1 | U$1.13 85.83,15.26 v85.34,15.75 | R9.2 C17.2 25.73,14.4 26.04,14.1 26.42,13.72 28.02,13.72 U3.4
  Top 0.61: R3.2 C3.2 45.98,12.66 46.08,12.55 | U1.4 46.5,12.14 46.08,12.55 | LED6.C 20.37,104.7 23.37,107.7 23.37,112.78 35.31,112.78 | 35.31,112.78 47.24,112.78 | 47.24,112.78 58.67,112.78 | 58.67,112.78 72.14,112.78 | 72.14,112.78 83.82,112.78 | 83.82,112.78 95.76,112.78 | 95.76,112.78 106.93,112.78 108.2,111.51 108.2,107.96 LED8.C | LED1.C 93.26,105.2 96.01,107.95 96.01,112.52 95.76,112.78 | LED2.C 81.3,105.17 84.07,107.95 84.07,112.52 83.82,112.78 | LED3.C 68.88,104.94 71.88,107.95 71.88,112.52 72.14,112.78 | 58.67,112.78 58.93,112.52 58.93,107.7 55.93,104.7 LED4.C | LED7.C 32.28,105.18 35.05,107.95 35.05,112.52 35.31,112.78 | LED5.C 43.95,104.91 46.99,107.95 46.99,112.52 47.24,112.78 | v44.96,11.43 46.08,12.55
  Top 0.813: IC1.1 63.13,7.76 66.04,10.67 66.04,12.74 C4.2 | 61.72,8.21 IC1.1 | v25.15,12.95 25.15,13.21 26.04,14.1 | IC1.1 C52.2 v59.69,8.89 | C51.2 45.79,2.54 C1.2 | C6.2 72.65,85.21 C5.C 74.17,84.84 v74.42,85.09
  Top 1.27: D4.A 25.64,2.5 C15.2 | C1.2 50.8,2.43 | 50.8,2.43 53.04,2.43 C2.2 | D1.A 50.94,2.57 50.8,2.43
  Bottom 0.254: v85.6,59.44 86.61,59.44 | 86.61,59.44 86.87,59.44 87.63,58.67 v87.63,57.4 | v85.6,62.23 86.36,61.47 86.61,61.47 86.61,59.44
  Bottom 0.305: v85.33,42.47 v85.33,36.88 84.43,37.78 C45.2 C47.2 C38.2 C46.2 78.22,37.86 v78.22,38.91 | C13.2 74.68,57.65 | 74.68,57.65 C14.2 | S5.3 73.79,64.13 74.68,63.25 74.68,57.65 | v89.92,61.47 86.61,61.47 | v84.84,85.09 85.09,85.09 85.34,84.84 C48.2 86.73,83.96 87.88,82.8 87.88,81.03 89.14,79.77 JP12.7 | v67.06,95.5 67.06,92.96 v70.61,89.41 | 65.53,12.88 C4.2 65.9,11.83 | v77.47,25.65 77.72,25.91 80.52,25.91 80.77,26.16 80.77,27.23 | J3.8 100.39,42.99 102.87,45.47 105.43,45.47 J3.SHIELD0 111.93,46.4 J3.12 | J3.SHIELD1 107.01,30.4 108.2,29.21 114.05,29.21 115.82,30.99 115.82,33.53 115.06,34.29 113.37,34.29 J3.10 | J2.8 100.39,21.4 104.14,25.15 106.03,25.15 J2.SHIELD0 107.2,25.65 112.78,25.65 113.32,25.11 J2.12 114.76,23.42 115.32,22.86 115.32,14.74 J2.10 112.1,13.97 107.44,13.97 106.36,12.89 J2.SHIELD1
  Bottom 0.406: C37.2 80.5,27.23 | 80.5,27.23 80.77,27.23 C36.2 | 80.5,27.23 80.5,29 v76.44,33.07 83.3,33.07 85.58,35.35 85.58,36.62 v85.33,36.88 | C25.2 81.34,7.16 C24.2 | v78.22,18.84 78.73,18.84 78.98,18.59 78.98,17.54 C33.2 | C34.2 C33.2 | C33.2 C28.2 C27.2 | v84.31,21.13 82.54,19.35 82.54,17.51 C27.2 | C27.2 84.43,17.46 85.34,16.54 v85.34,15.75 | v100.08,57.66 108.97,57.66 109.98,58.67 109.98,60.71 108.97,61.72 107.32,61.72 JP3.GND | v70.61,89.41 80.52,89.41 v84.84,85.09 84.33,85.6 81.03,85.6 75.64,80.21 S2.3 | IC5.2 84.5,71.8 84.07,71.37 84.07,69.34 86.36,67.06 89.15,67.06 91.98,67.06 JP2.1 | 74.68,57.65 74.68,55.63 74.19,55.14 S3.4 64.52,55.14 63.75,54.38 63.75,49.78 65.27,48.27 S4.4
  Bottom 0.61: BAT1.2 57.63,27.46 57.4,27.69
  Bottom 0.813: C15.2 24.35,12.16 v25.15,12.95 | v59.69,8.89 59.69,9.65 | v74.42,85.09 74.42,85.6 v70.61,89.41
  Bottom 1.27: C4.2 65.9,20.72 58.93,27.69 57.4,27.69 54.1,27.69 51.56,30.23 51.56,50.8 | 51.56,50.8 51.56,78.74 | 51.56,78.74 51.56,90.19 R30.3 53.17,90.34 58.17,85.34 59.39,85.34 JP11.1 | U6.16 51.44,50.93 51.56,50.8 | C4.2 65.9,12.08 68.07,9.91 76.45,9.91 | 76.45,9.91 81.03,9.91 | 81.03,9.91 86.61,9.91 88.65,11.94 88.65,13.72 | 88.65,13.72 88.65,15.75 | 88.65,15.75 88.65,36.83 | 88.65,36.83 88.65,44.7 92.2,48.26 103.63,48.26 JP5.2 106.17,53.85 103.63,56.39 101.35,56.39 v100.08,57.66 90.17,57.66 v85.6,62.23 85.6,63.5 89.15,67.06 91.95,67.06 92.2,66.8 | JP2.1 92.31,66.18 93.47,65.02 | 106.43,50.8 112.01,50.8 113.79,52.58 113.79,68.07 115.57,69.85 115.57,77.22 | 115.57,77.22 115.57,102.62 113.03,105.16 109.22,105.16 101.6,97.54 88.65,97.54 86.36,99.82 65.28,99.82 62.23,96.77 62.23,87.38 | 62.23,87.38 62.23,86.11 61.47,85.34 59.44,85.34 | 62.23,87.38 64.77,87.38 66.04,88.65 66.04,94.49 v67.06,95.5 | U6.5 51.44,78.87 51.56,78.74 | X1.5 108.91,78.29 109.98,77.22 115.57,77.22 | v76.45,11.18 76.45,9.91 | 81.34,7.16 81.34,9.59 81.03,9.91 | v85.34,15.75 88.65,15.75 | 88.65,13.72 90.17,13.72 91.69,15.24 91.69,24.89 93.73,26.92 | 93.73,26.92 104.9,26.92 106.17,25.65 106.17,25 J2.SHIELD0 J3.SHIELD1 | 93.73,26.92 91.69,28.96 91.69,44.7 92.46,45.47 | v85.33,36.88 88.6,36.88 88.65,36.83 | U$2.P$2 11.41,9.67 19.3,1.78 23.88,1.78 24.38,2.29 24.38,3.76 C15.2 41.47,3.79 | 41.47,3.79 42.43,3.79 43.69,2.54 45.79,2.54 C1.2 | 41.47,3.79 41.47,7.94 v44.96,11.43 | C2.2 55.01,8.78 56.39,10.16 63.18,10.16 C4.2
  pour Bottom (isolate 0.406): 15.24,114.3 105.41,114.3 111.76,107.95 118.11,107.95 118.11,49.53 90.17,49.53 86.36,45.72 86.36,2.54 61.47,2.54 61.47,23.37 46.99,23.37 47,90.5 51,90.5 51,98 47,98 47,100.33 21.59,100.33 15.24,106.68
  pour Bottom: 8.38,1.52 60.71,1.52 60.71,16.26 8.38,16.51
  pour Top (isolate 0.406): 15.49,114.05 105.41,114.05 111.76,107.7 117.86,107.7 117.86,49.78 89.92,49.78 86.11,45.97 86.11,2.79 61.72,2.79 61.72,24.13 47.24,23.88 47.24,100.58 21.84,100.58 15.49,106.93
  pour Bottom: 92.71,46.99 118.11,46.99 118.36,46.74 118.36,9.14 112.78,9.14 110.24,6.6 110.24,2.54 89.92,2.54 89.92,44.2 92.46,46.74
  pour Top: 92.71,46.74 117.86,46.74 118.11,46.48 118.11,9.4 112.78,9.4 109.98,6.6 109.98,2.79 90.17,2.79 90.17,44.2
I2C1_SCL
  Top 0.254: U2.42 87.65,64.79 89.92,67.06 89.92,68.83 | 89.92,68.83 89.92,69.09 89.41,69.6 88.13,69.6 R29.2 | 89.92,68.83 93.4,68.83 JP4.2
  Bottom 0.254: JP4.2 94.84,70.76 93.73,71.88 90.42,71.88 89.35,70.8 IC5.6
  Bottom 0.305: 88.14,70.76 IC5.6
I2C1_SDA  (via drill 0.5 pad 0.81)
  Top 0.254: U2.43 87.14,65.04 89.15,67.06 89.15,68.53 88.95,68.73 86.72,68.73 86.36,69.09 86.36,69.59 R28.2 85.15,69.66 v85.09,69.6 85.09,70.1 85.6,70.61 89.41,70.61 89.74,70.28 JP4.3
  Bottom 0.305: v85.09,69.6 85.09,70.7 IC5.1
LA1
  Top 0.305: R17.1 97.23,11.48 98.55,10.16 104.39,10.16 106.17,11.94 106.17,12.7 107.44,13.97 111.51,13.97 112.01,13.46 112.01,11.52 J2.9
LA2
  Top 0.305: R26.1 97.11,32.94 98.3,31.75 104.65,31.75 105.92,33.02 105.92,33.78 107.7,35.56 111.51,35.56 112.01,35.05 112.01,33.11 J3.9
LB1
  Top 0.305: R18.1 95.96,9.7 95.63,10.03 95.63,12.32 96.01,12.7 97.54,12.7 99.31,10.92 104.14,10.92 105.41,12.19 105.41,12.96 J2.11
LB2
  Top 0.305: R27.1 96.09,31.42 95.68,31.83 95.68,33.96 96.01,34.29 97.54,34.29 99.31,32.51 104.14,32.51 104.9,33.27 104.9,34.05 J3.11
LCD_D4
  Top 0.254: U6.11 55.75,63.63 56.39,64.26 61.21,64.26 63.75,66.8 63.75,80.77 69.08,86.1 U$5.27
LCD_D5
  Top 0.254: U6.12 47.88,60.96 54.36,60.96 56.9,63.5 61.72,63.5 64.52,66.29 64.52,80.52 69.58,85.58 U$5.28
LCD_D6
  Top 0.254: U6.13 53.21,58.55 57.4,62.74 62.23,62.74 65.28,65.79 65.28,80.26 70.08,85.07 U$5.29
LCD_D7
  Top 0.254: U6.14 51.94,56.01 57.91,61.98 62.74,61.98 66.04,65.28 66.04,80.01 66.04,80.21 70.59,84.76 70.58,84.76 U$5.30
LCD_E
  Top 0.254: U6.6 58.29,76.33 58.47,76.33 68.58,86.44 U$5.26
LCD_RS
  Top 0.254: U6.4 61.59,81.41 67.56,87.38 67.96,87.38 U$5.25
N$1
  Bottom 1.676: U$14.P$2 37.97,87.02 K1.P
N$2
  Top 0.254: U4.16 104.48,87.21 104.9,87.63 C22.2
N$3
  Top 0.254: D5.2 70.87,51.62 70.87,48.51 67.19,44.84 BAT1.1
N$4
  Top 0.61: C3.1 48.91,13.79 49.67,13.03 49.67,11.25 49.29,10.87 U1.3
N$5
  Top 0.813: U1.2 50.89,9.6 50.94,9.65
  Top 1.27: D1.C 50.94,9.65 50.94,12.08 55.63,16.76 55.63,19.6 L1.1
N$6
  Top 0.61: R2.1 R3.1 42.42,12.2 U1.5
N$7
  Top 0.254: U2.6 79.47,59.91 78.99,59.44 77.27,59.44 Y2.1
  Bottom 0.254: R46.1 76.95,59.69 Y2.1
  Bottom 0.305: C14.1 77.35,59.28 Y2.1
N$8
  Top 0.305: LED13.A 65.81,19.53 66.29,19.05 66.29,17.39 R44.2
N$9
  Top 0.61: R37.2 28.31,103.96 LED7.A
N$10
  Top 0.254: R5.2 102.99,60.33 104.14,59.18 JP3.D-
N$11
  Top 0.254: R6.2 103.47,62.9 103.89,62.48 103.89,61.21 104.65,60.45 106.02,60.45 JP3.D+
N$12
  Top 0.254: U6.3 52.93,83.95 R30.2
N$13
  Top 1.676: U$17.P$1 11.94,21.94 14,24 20.69,24 K4.O
N$14
  Top 0.254: U2.3 81.84,61.41 80.01,63.25 80.01,63.78 Y1.1 80.01,63.98 80.01,65.53 80.31,65.84 C12.1
N$15
  Top 0.254: U2.4 79.69,60.9 Y1.4 76.71,65.53 76.37,65.87 C11.1
N$16
  Top 0.254: U2.5 78.01,60.42 77.47,60.96 73.71,60.96 Y2.2
  Bottom 0.254: R46.2 72.44,59.69 Y2.2
  Bottom 0.305: C13.1 72.03,59.28 Y2.2
N$17
  Top 0.254: U$5.31 71.08,83.16 R48.1
N$21
  Top 1.676: U$17.P$3 22.76,32.1 K4.S
N$22
  Top 0.406: U3.3 29.54,12.52 29.97,12.95 29.97,14.73 29.46,15.24 27.61,15.24 C17.1
N$24
  Top 0.813: U3.2 31.68,11.25 31.75,11.18
  Top 1.27: L3.1 34.76,14.44 31.75,11.43 31.75,11.18 31.75,7.11 31.5,6.86 28.14,6.86 D4.C
N$25
  Top 0.406: U3.5 21.77,13.79 21.34,14.22 R9.1
  Top 0.813: R8.1 21.32,15.33 R9.1
N$26
  Top 0.254: U4.2 100.82,85.84 101.09,86.11 101.09,87.63 100.33,88.39 100.21,88.39 C21.2
N$27
  Top 0.254: U4.6 97.2,80.76 C20.2
N$28
  Top 0.254: U4.3 98.57,84.57 98.04,85.09 97.42,85.09 C18.2
N$29
  Top 0.254: C18.1 U4.1
N$30
  Top 0.254: U4.5 C19.1
N$31
  Top 0.254: U4.4 98.82,83.3 98.3,83.82 C19.2
N$33  (via drill 0.5 pad 0.81)
  Top 0.406: U$1.3 78.97,11.49 79.74,10.72 82.54,10.72 84.31,8.94 Y3.P$1 86.35,8.24 v86.35,7.41
  Bottom 0.406: C24.1 86.09,7.16 v86.35,7.41
N$34
  Top 0.254: C40.A 73.02,34.22 74.33,35.53 U$3.43
N$35  (via drill 0.5 pad 0.81)
  Top 0.254: U$3.2 78.32,30.94 Y4.P$2 75.42,28.05 v75.42,27.48
  Bottom 0.406: C37.1 75.68,27.23 v75.42,27.48
N$36
  Top 0.305: U$1.16 88.04,17.66 88.38,17.32 88.38,16.56 88.63,16.3 91.06,16.3 R15.2 91.27,15.44 91.43,15.29 94.26,15.29 C30.1
N$37
  Top 0.406: U$1.43 74.58,15.16 C26.A
N$38
  Top 0.305: U$1.17 89.77,18.46 90.16,18.84 92.7,18.84 92.95,18.59 R14.2 94.58,17.89 C31.1
N$39
  Top 0.254: U$3.11 86.6,33.03 R19.2
N$40  (via drill 0.5 pad 0.81)
  Top 0.406: U$1.2 78.17,10.06 Y3.P$2 76.44,8.33 v76.44,7.41
  Bottom 0.406: C25.1 76.69,7.16 v76.44,7.41
N$41
  Top 0.406: U$1.11 86.53,12.66 R10.2
N$42  (via drill 0.5 pad 0.81)
  Top 0.406: v78.22,20.37 82.03,20.37 84.57,22.91 U$1.24
  Bottom 0.406: R11.1 75.5,18.92 76.95,20.37 v78.22,20.37
N$43
  Top 0.406: U$1.10 84.57,11.73 85.08,11.22 93.46,11.22 93.71,11.48 R17.2
N$44
  Top 0.406: U$1.9 83.77,11.26 84.57,10.46 92.95,10.46 93.71,9.7 R18.2
N$45
  Top 0.406: R16.2 R13.2 R12.2 L4.1
N$46  (via drill 0.5 pad 0.81)
  Top 0.254: v77.46,40.69 82.03,40.69 84.72,43.38 U$3.24
  Bottom 0.305: R20.1 76.19,39.42 v77.46,40.69
N$47  (via drill 0.5 pad 0.81)
  Top 0.254: U$3.3 79.12,31.66 81.77,29 Y4.P$1 85.58,28.4 v85.58,27.48
  Bottom 0.406: C36.1 85.33,27.23 v85.58,27.48
N$48
  Top 0.254: U$3.16 88.36,38.03 88.63,37.77 88.63,37.26 89.27,36.88 91.23,36.88 R24.2 91.43,36.5 91.93,35.99 94.26,35.99 C42.1
N$49
  Top 0.254: U$3.17 88.94,38.83 89.9,39.8 92.95,39.8 93.2,39.55 R23.2 94.73,38.87 C43.1
N$50
  Top 0.254: L5.1 R21.2 R22.2 R25.2
N$51
  Top 0.254: U$3.10 84.72,31.9 84.82,31.8 92.44,31.8 93.58,32.94 R26.2
N$52
  Top 0.254: U$3.9 83.92,31.18 84.06,31.04 93.71,31.04 93.97,31.29 94.67,31.29 R27.2
N$53
  Top 1.676: U$16.P$3 22.71,52.07 K3.S
N$54
  Bottom 1.676: U$15.P$2 K2.P
N$55
  Top 1.676: U$16.P$1 22.79,41.91 K3.O
N$56
  Top 1.676: U$15.P$1 22.74,61.91 K2.O
N$57
  Top 1.676: U$15.P$3 22.72,72.07 K2.S
N$58
  Bottom 1.676: U$16.P$2 37.93,46.99 K3.P
N$59
  Top 1.676: U$14.P$1 22.75,81.94 K1.O
N$60
  Bottom 1.676: U$17.P$2 K4.P
N$61
  Top 1.676: U$14.P$3 11.9,92.1 14,90 20.68,90 K1.S
N$62
  Top 0.406: K1.2 40.99,93 T1.3
  Bottom 0.61: D7.A 43.45,91.68 41.91,93.22 36.09,93.22 K1.2
N$63
  Top 0.406: T2.3 35.88,73.05 K2.2
  Bottom 0.61: D6.A 43.45,70.69 41.15,73 K2.2
N$64
  Top 0.61: T3.3 35.9,52.98 K3.2
  Bottom 0.61: D2.A 43.35,50.73 41.06,53.02 K3.2
N$65
  Top 0.61: T4.3 36.02,33.17 K4.2
  Bottom 0.61: D3.A 43.35,30.91 41.26,33.01 K4.2
N$66
  Top 0.406: LED12.A R42.2
N$67
  Top 0.406: LED11.A R41.2
N$68
  Bottom 1.27: U$2.P$1 16.46,10.97 15.24,12.19 15.24,14.65 D8.A
N$69
  Top 0.254: JP11.3 59.55,90.42 61.21,90.42 62.29,89.35 U$5.23
N$70
  Top 0.406: LED10.A 8.51,57.05 R40.2
N$71
  Top 0.254: JP11.2 59.55,87.88 61.47,87.88 62.43,88.85 U$5.24
N$72
  Top 0.61: LED9.A R39.2
N$73
  Top 0.61: R31.2 89.46,103.89 LED1.A
N$74
  Top 0.61: R32.2 101.19,103.95 LED8.A
N$75
  Top 0.61: R33.2 77.51,103.9 LED2.A
N$77
  Top 0.254: U$4.P$2 85.48,82.16 85.85,81.79 85.85,79.62 R43.1 86.73,78.51 91.11,78.51 92.32,79.72 JP12.8
N$78
  Top 0.61: R34.2 65.35,103.92 LED3.A
N$80
  Top 0.61: R36.2 40.42,104.19 LED5.A
N$82
  Top 0.61: R35.2 52.43,104.21 LED4.A
N$87
  Top 0.61: R38.2 16.59,103.95 LED6.A
RX1+
  Top 0.305: J2.4 99.23,16.18 98.81,15.75 96.62,15.75 C30.2
RX1-
  Top 0.305: J2.6 98.73,18.72 98.04,18.03 96.62,18.03 C31.2
RX1_CT
  Top 0.305: C32.2 89.65,17.57 89.9,17.83 91.21,17.83 R15.1 91.27,17.76 R14.1 92.99,16.09 93.81,16.91 98.82,16.91 99.35,17.45 J2.5
RX2+
  Top 0.305: C42.2 96.65,36.58 98.04,36.58 99.23,37.77 J3.4
RX2-
  Top 0.254: C43.2 97.65,38.91
  Top 0.305: 97.65,38.91 99.05,40.31 J3.6
RX2_CT
  Top 0.254: C44.2 89.78,38.53 90.16,38.91 91.39,38.91 R24.1 91.43,38.85 R23.1 93.39,37.07 93.97,37.64 97.9,37.64
  Top 0.305: 97.9,37.64 99.3,39.04 J3.5
SPI1_MISO  (via drill 0.5 pad 0.81)
  Top 0.254: 70.87,25.4 69.34,26.92 69.34,30.48 68.83,30.99 68.83,43.43 76.71,51.31 85.6,51.31 v86.11,51.82 | U2.16 86.15,56.85 v86.11,56.9
  Top 0.305: U$1.35 74.7,21.56 73.15,23.11 73.15,23.37 JP1.2 70.87,25.4
  Bottom 0.305: v86.11,51.82 v86.11,56.9
SPI1_MOSI
  Top 0.254: 68.58,25.65 68.58,30.23 68.07,30.73 68.07,43.69 76.45,52.07 85.09,52.07 86.63,53.61 U2.17
  Top 0.305: U$1.36 73.22,20.76 JP1.3 71.12,23.11 68.58,25.65
SPI1_SCK
  Top 0.254: 67.56,23.88 67.56,29.97 67.31,30.23 67.31,43.94 76.2,52.83 84.84,52.83 85.64,53.63 U2.15
  Top 0.305: U$1.37 71.48,19.96 JP1.4 67.56,23.88
SPI1_SS1_ETH1
  Top 0.254: 75.67,23.39 JP1.1 71.12,30.23 69.6,31.75 69.6,43.18 76.96,50.55 86.36,50.55 87.12,51.31 87.12,52.07 86.87,52.32 86.87,52.83 87.12,53.09 87.12,55.43 U2.18
  Top 0.305: U$1.34 75.67,23.39
SPI2_MISO
  Top 0.254: 100.58,54.86 100.58,55.88 98.05,58.41 U2.28 | U5.2 100.69,54.97 100.58,54.86 | U$3.35 74.65,41.93 74.42,42.16 74.42,44.96 77.47,48.01 93.98,48.01 95.5,49.53 95.5,50.29 JP5.6 97.28,49.53 99.31,49.53 99.82,50.04 99.82,51.82 100.58,52.58 100.58,54.86
SPI2_MOSI
  Top 0.254: U5.5 97.94,57.51 99.31,56.13 99.31,53.09 98.55,52.32 | 94.51,57.4 U5.5 | 98.55,52.32 JP5.5 | U$3.36 74.44,41.13 73.66,41.91 73.66,45.21 77.22,48.77 93.47,48.77 94.74,50.04 94.74,51.56 95.25,52.07 98.3,52.07 98.55,52.32 | U2.27 94.23,57.91 U5.5
SPI2_SCK
  Top 0.254: U$3.37 74.22,40.33 72.9,41.66 72.9,45.47 76.96,49.53 92.2,49.53 JP5.7 93.98,51.31 93.98,52.58 94.23,52.83 95.5,52.83 96.27,53.59 96.27,55.88 95.9,56.24 U5.6 94.48,56.39 93.98,56.39 92.97,57.4 U2.26
SPI2_SS1_ETH2
  Top 0.254: U$3.34 75.95,42.86 75.95,45.47 77.72,47.24 94.23,47.24 95.25,48.26 102.62,48.26 103.63,49.28 JP5.3 103.89,51.05 103.89,58.17 102.62,59.44 99.57,59.44 99.31,59.18 93.22,59.18 92.93,58.9 U2.29
SPI2_SS2_FLASH  (via drill 0.5 pad 0.81)
  Top 0.254: U5.1 101.84,51.55 JP5.4 | v92.79,56.11 91.97,56.11 91.61,56.47 U2.25
  Bottom 0.254: JP5.4 101.09,54.61 99.31,56.39 93.07,56.39 v92.79,56.11
SW0
  Top 0.254: S1.2 S1.1 73.15,80.23 73.15,81.28 73.66,81.79 77.72,81.79 78.49,82.55 78.49,85.6 74.74,89.35 U$5.2
SW1
  Top 0.254: S2.2 S2.1 80.26,80.49 80.26,84.84 75.25,89.85 U$5.3
SW2
  Top 0.254: S3.1 S3.2 69.77,55.37 78.49,55.37 78.99,54.86 83.82,54.86 84.33,54.36 85.09,54.36 85.13,54.4 U2.14
SW3  (via drill 0.5 pad 0.81)
  Top 0.254: S4.1 S4.2 67.52,52.79 69.34,54.61 72.64,54.61 73.15,54.1 82.42,54.1 82.68,54.36 83.57,54.36 v84.33,53.59 | v87.88,52.58 87.63,52.83 87.63,55.43 U2.19
  Bottom 0.254: v84.33,53.59 84.33,52.07 85.6,50.8 86.61,50.8 87.12,51.31 87.12,51.82 v87.88,52.58
SWDCLK
  Top 0.254: JP2.2 93.5,68.07 90.93,68.07 90.68,67.82 90.68,65.28 90.14,64.73 U2.37
SWDIO
  Top 0.254: U2.34 92.91,61.41 97.54,66.04 97.54,66.58 JP2.3
TX1+  (via drill 0.5 pad 0.81)
  Top 0.406: U$1.20 92.68,20.86 v92.95,21.13 R12.1
  Bottom 0.305: J2.1 98.63,12.37 95.76,15.24 95.76,20.14 R12.1 v92.95,21.13
TX1-  (via drill 0.5 pad 0.81)
  Top 0.406: U$1.21 91.96,21.66 v92.95,22.65 R13.1
  Bottom 0.305: J2.3 98.12,14.91 97.79,15.24 97.79,21.59 96.77,22.61 93,22.61 v92.95,22.65
TX1_CT
  Top 0.305: J2.2 104.31,13.64 104.9,14.22 104.9,21.59 101.04,25.45 95.04,25.45 94.74,25.15 94.74,24.2 R16.1
  Top 0.406: C29.1 R16.1
TX2+  (via drill 0.5 pad 0.81)
  Top 0.254: U$3.20 92.48,41.23 v93.2,41.96 R21.1
  Bottom 0.305: J3.1 102.76,33.78 99.06,33.78 96.52,36.32 96.52,41.4 96.01,41.91 95.76,41.91 95.71,41.96 v93.2,41.96
TX2-  (via drill 0.5 pad 0.81)
  Top 0.254: U$3.21 91.5,42.03 v92.95,43.48 R22.1
  Bottom 0.305: J3.3 99.14,36.5 97.79,37.85 97.79,42.42 96.73,43.48 v92.95,43.48
TX2_CT
  Top 0.254: C41.1 92.4,45.01 R25.1 94.73,45.04 94.73,45.45 95.76,46.48 100.11,46.48
  Top 0.305: 100.11,46.48 100.58,46.48 104.65,42.42 104.65,36.07 103.81,35.23 J3.2
UART_RX1
  Top 0.254: U2.22 89.14,53.6 90.93,51.82 JP6.1
UART_RX2  (via drill 0.5 pad 0.81)
  Top 0.254: v97.54,63.5 97.54,64.01 98.55,65.02 100.84,65.02 101.6,65.79 101.6,80.77 102.87,82.04 104.46,82.04 U4.12 105.93,82.03 106.68,81.28 106.68,74.3 105.41,73.03 JP7.2 | U2.31 90.2,59.91 v90.17,59.94
  Bottom 0.305: v90.17,59.94 93.98,59.94 v97.54,63.5
UART_TX1
  Top 0.254: JP6.2 88.39,51.05 88.9,51.56 88.9,53.09 88.65,53.34 U2.21
UART_TX2  (via drill 0.5 pad 0.81)
  Top 0.254: U2.30 92.68,59.4 92.96,59.69 98.55,59.69 98.81,59.94 v98.81,60.2 | 102.62,75.56 102.62,68.58 102.36,68.33 102.36,65.53 100.84,64.01 99.31,64.01 v98.81,63.5 | 102.62,75.56 102.62,80.26 103.12,80.77 104.46,80.77 U4.11 | JP7.3 102.62,75.56
  Bottom 0.305: v98.81,60.2 v98.81,63.5
USB_D+
  Top 0.254: U2.33 96.72,60.9 98.3,62.48 100.77,62.48 R6.1
  Top 0.305: R6.1 101.19,63.09 103.38,65.28 103.38,66.29 103.75,66.66 R45.1
USB_D-
  Top 0.254: U2.32 97.5,60.42 98.3,61.21 101.1,61.21 R5.1
VBAT  (via drill 0.5 pad 0.81)
  Top 0.254: D5.3 74.19,52.6 74.93,53.34 82.8,53.34 v83.06,53.59 | v83.31,63.5 83.31,62.54 U2.1
  Bottom 0.254: v83.06,53.59 83.31,53.85 83.31,55.88
  Bottom 0.305: 83.31,55.88 v83.31,63.5
VIN
  Top 0.813: U3.6 20.9,12.52 20.58,12.2 R7.2 20.57,6.35 21.81,5.12 C15.1
  Bottom 1.27: C15.1 21.1,3.79 19.56,5.33 19.56,14.56 D8.C
VIN2
  pour Top (no thermals): 21.59,11.43 26.67,11.43 26.67,10.41 30.48,10.41 30.48,7.87 26.92,7.87 26.92,6.86 21.59,6.86
VIN3
  pour Top (no thermals): 41.15,10.41 45.97,10.41 45.97,8.89 49.28,8.89 49.28,6.6 41.15,6.6

## Text on the board
tPlace: DI6 | DI4 | DI1 | DI0 | DI7 | DI5 | DI3 | DI2 | RS232 | R0 | SWD1 | Exp Slot | SWD | SWCK | GND | S4 | SniperBoard / v1.0 | R1 | S3 | TX2 | RX2 | I2C | Reset | GND | DAT | CK | GND | SWD0 | GND | SWCK | SWD | R2 | S1 | USB | S2 | TX1 | RX1 | SCK2 | SO2 | SI2 | SS2F | SS2E | GND | GND | MAC0 | R3 | CR2032 | SS1E | SI1 | MAC1 | SO1 | SCK1 | 24V DC | 3.3V